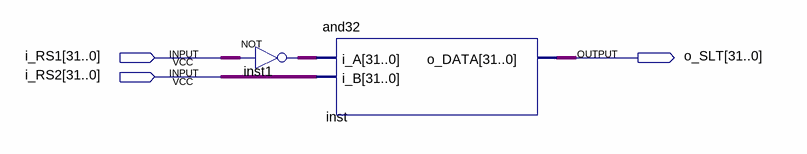
[diagram p0: schematic sheet]
// Quartus schematic slt.bdf as structural Verilog: 2 symbols, 3 pins
module slt (
  input  [31:0] i_RS1,
  input  [31:0] i_RS2,
  output [31:0] o_SLT
);

  wire [31:0] inst1_out;

  assign inst1_out = ~i_RS1;  // NOT inst1, 32 bits wide
  and32 inst (.i_A(inst1_out), .i_B(i_RS2), .o_DATA(o_SLT));
endmodule
